# EAGLE design Zio Qwiic Light Sensor TSL2561 (EAGLE 9.1.1)
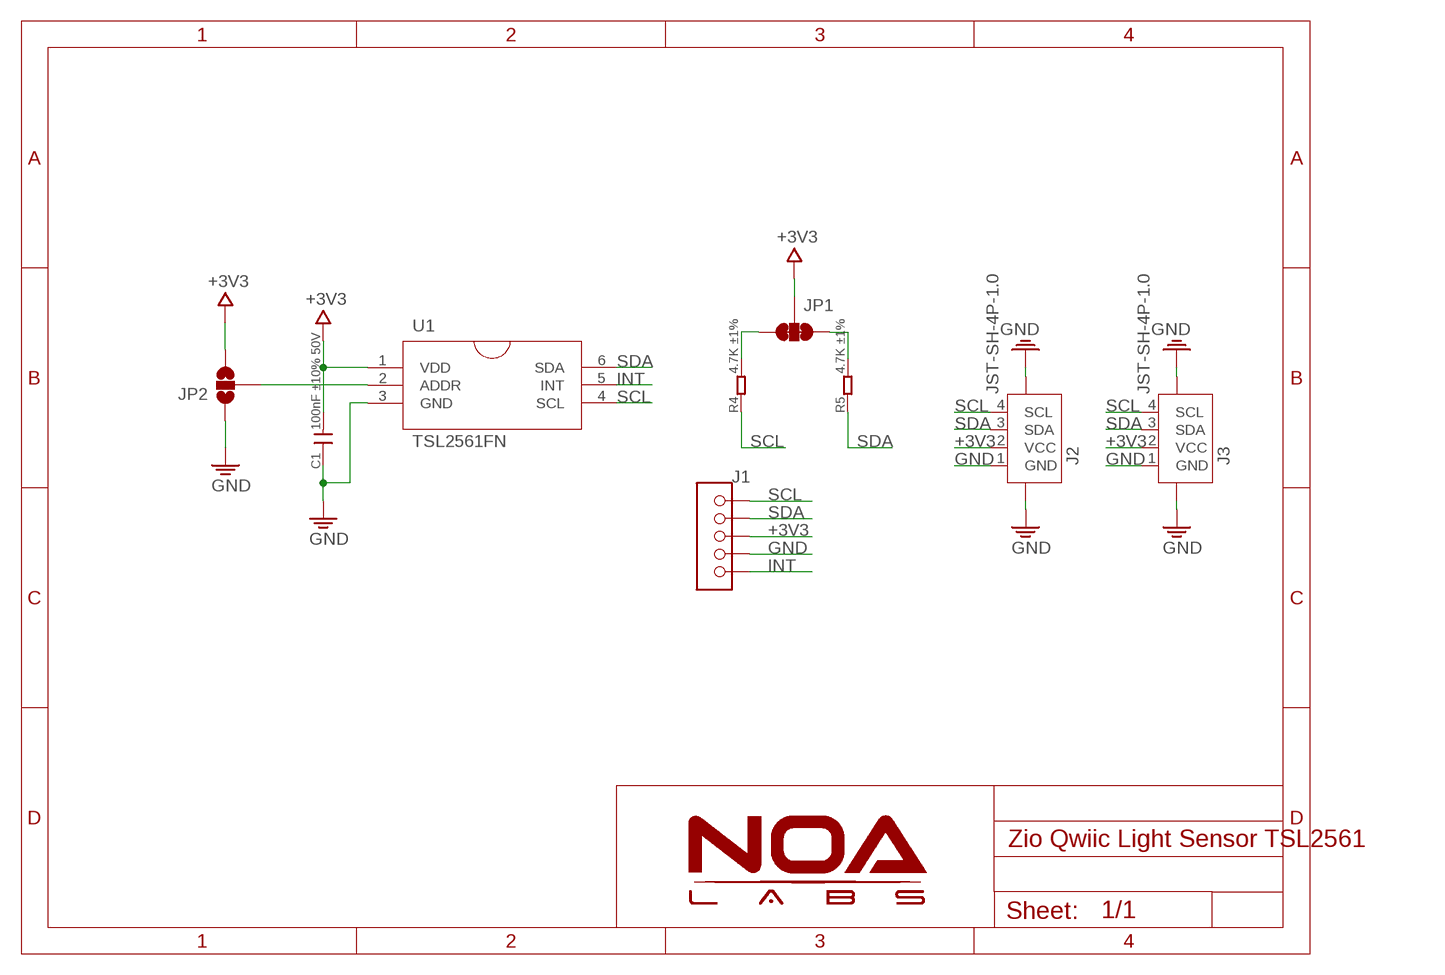
[diagram p0: schematic, sheet 1]

## Parts
C1  100nF ±10% 50V  C-0603  [C0603]
J1  HEADER-5P-2.54  [5P-2.54]
J2  JST-SH-4P-1.0  [JST-SH-4P]
J3  JST-SH-4P-1.0  [JST-SH-4P]
JP1  SMT-JUMPER_3_2-NC_TRACE  [SMT-JUMPER_3_2-NC_TRACE]
JP2  JUMPER-SMT_3_2-NC_PASTE_NOCREM  [SMT-JUMPER_3_2-NC_PASTE_SILK_NOCREM]
R4  4.7K ±1%  R-0603  [R0603]
R5  4.7K ±1%  R-0603  [R0603]
U1  TSL2561FN  [FN6]

## Nets
+3V3: C1.2 J1.3 J2.2(VCC) J3.2(VCC) JP1.2 JP2.3 U1.1(VDD)
GND: C1.1 J1.4 J2.1(GND) J2.NC1 J2.NC2 J3.1(GND) J3.NC1 J3.NC2 JP2.1 U1.3(GND)
INT: J1.5 U1.5(INT)
N$1: JP2.2 U1.2(ADDR)
N$6: JP1.3 R4.2
N$8: JP1.1 R5.2
SCL: J1.1 J2.4(SCL) J3.4(SCL) R4.1 U1.4(SCL)
SDA: J1.2 J2.3(SDA) J3.3(SDA) R5.1 U1.6(SDA)

## Library data of the parts
C1 = RCL:C
J1 = Connector:HEADER-5P
J2 J3 = Connector:JST-SH-4P
JP1 = NOA-Jumpers:SMT-JUMPER_3_2-NC_TRACE
JP2 = NOA-Jumpers:JUMPER-SMT_3_2-NC_PASTE_NOCREM
R4 R5 = RCL:R
U1 = IC:TSL2561FN

## Board
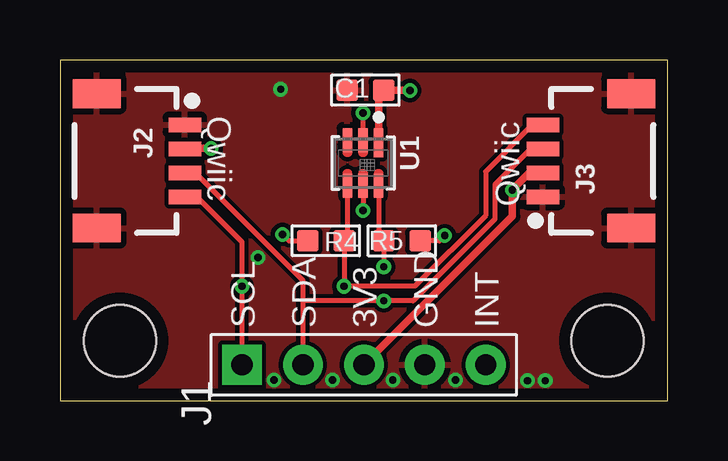
[diagram p1: board, top side]
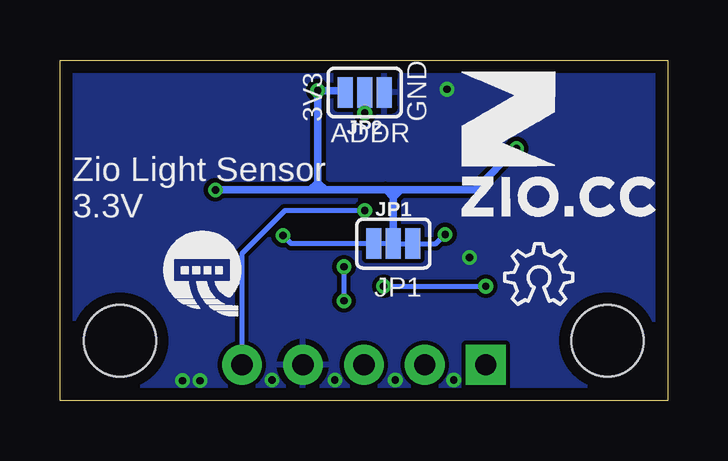
[diagram p2: board, bottom side, seen from below]

Size 25.32 x 14.2 mm. Coordinates in mm from the lower left corner, seen from the top.
Outline: 0,0 25.32,0 25.32,14.2 0,14.2 0,0
Copper layers (1*16): Top 0.035mm / dielectric 1.5mm / Bottom 0.035mm
Design rules "NOA Eagle Rule": minimum track width 7mil, minimum drill 12mil, track to track 7mil, track to pad 7mil, pad to pad 7mil, via to via 7mil, smd to smd 0mil, copper to edge 20mil, drill to drill 10mil, minimum pad ring 10mil, minimum via ring 6mil, stop-mask expansion 2mil, vias tented up to drill 25mil, thermal gap 10mil
Holes 3 mm at 2.5,2.5 22.82,2.5

### Footprints (pad centres in the part's own frame; a part is rotated, then mirrored left to right if it is on the bottom)
C0603 = smd 0.889 x 0.889: 1 -0.762,0; 2 0.762,0
5P-2.54 = drill 0.889 pad 1.651 square: 1 0,5.08 | drill 0.889 pad 1.651: 2 0,2.54; 3 0,0; 4 0,-2.54; 5 0,-5.08
JST-SH-4P = smd 0.6 x 1.35: 1 1.5,0; 2 0.5,0; 3 -0.5,0; 4 -1.5,0 | smd 1.2 x 2: NC1 -2.8,3.675; NC2 2.8,3.675
SMT-JUMPER_3_2-NC_TRACE = smd 0.635 x 1.27: 1 -0.813,0; 2 0,0; 3 0.813,0
SMT-JUMPER_3_2-NC_PASTE_SILK_NOCREM = smd 0.635 x 1.27: 1 -0.813,0; 2 0,0; 3 0.813,0
R0603 = smd 0.889 x 0.889: 1 -0.762,0; 2 0.762,0
FN6 = smd 1.2 x 0.4: 1 -0.85,0.65 | smd 1 x 0.4: 2 -0.95,0; 3 -0.95,-0.65; 4 0.95,-0.65; 5 0.95,0; 6 0.95,0.65

### Placement (x,y rotation side)
C1  12.73,12.94 0 top
J1  12.66,1.5 90 top
J2  5.2,10 90 top
J3  20.12,10 270 top
JP1  11.43,6.55 0 bottom
JP2  12.62,12.85 180 bottom
R4  11.08,6.67 180 top
R5  14.24,6.67 0 top
U1  12.63,9.91 270 top
U$4  [6MM]  8.61,7.7 0 bottom
U$5  [QWIIC-LOGO-BASIC]  19.43,5.28 0 bottom
U$6  [OSHW_6X100_NOTEXT]  6.78,4.01 0 bottom

### Tracks (layer width: path | path; a pad name or v marks a point on that pad's centre or on a via)
+3V3  (via drill 0.3)
  Top 0.305: J3.2 19.56,9.5 v18.85,8.79 18.85,7.69 J1.3 | v6.3,10.52 5.22,10.52 J2.2 | v14.58,12.93 14.57,12.94 C1.2 13.28,12.73 U1.1
  Bottom 0.305: v18.85,8.79 14.94,8.79 | 14.94,8.79 14.28,8.79 | 14.28,8.79 11.79,8.79 | 11.79,8.79 11.12,8.79 | 11.12,8.79 8.03,8.79 v6.3,10.52 | 14.58,9.09 v14.58,12.93 13.52,12.93 JP2.3 | 14.58,9.09 14.28,8.79 | 14.58,9.09 14.88,8.79 14.94,8.79 | 11.43,8.48 11.12,8.79 | 11.43,8.48 11.73,8.79 11.79,8.79 | JP1.2 11.43,8.48
GND  (via drill 0.3)
  other vias: 16.48,0.86 13.87,0.86 11.35,0.86 8.92,0.86 19.48,0.84 20.22,0.84 8.26,5.97 9.19,12.98
  pour Bottom: 0,14.2 25.32,14.2 25.32,0 0,0
  pour Top: 0,14.2 25.32,14.2 25.32,0 0,0
INT  (via drill 0.3)
  Top 0.203: v12.62,7.92 12.62,7.93 12.63,7.95 U1.5
  Bottom 0.203: v12.62,7.92 15.95,7.92 17.74,6.14 J1.5
N$1  (via drill 0.3)
  Top 0.203: v12.62,11.99 v12.62,11.98 12.63,11.97 U1.2
  Bottom 0.203: v12.62,11.99 JP2.2
N$6  (via drill 0.3)
  Top 0.203: v9.27,6.93 9.54,6.67 R4.2
  Bottom 0.203: JP1.3 9.66,6.55 v9.27,6.93
N$8  (via drill 0.3)
  Top 0.203: v16.03,6.88 15.81,6.67 R5.2
  Bottom 0.203: JP1.1 15.69,6.55 v16.03,6.88
SCL  (via drill 0.3)
  Top 0.203: J2.4 5.7,8.5 7.58,6.62 7.58,5.31 v7.58,4.78 J1.1 | J3.4 19.68,11.5 17.73,9.55 17.73,7.72 14.79,4.78 v11.84,4.78 R4.1 11.98,6.81 U1.4
  Bottom 0.203: v11.84,4.78 v7.58,4.78
SDA  (via drill 0.3)
  Top 0.203: J2.3 5.64,9.5 10.01,5.13 10.12,5.02 10.12,5 10.12,4.85 10.12,4.17 | 10.12,4.17 J1.2 | J3.3 19.62,10.5 18.12,9 18.12,7.99 18.12,7.57 14.71,4.17 v13.49,4.17 10.12,4.17 | U1.6 13.28,6.87 R5.1 13.48,5.6 v13.49,5.59
  Bottom 0.203: v13.49,5.59 v13.49,4.17

### Text on the board
tPlace: Qwiic | Qwiic | SCL | SDA | 3V3 | GND | INT
bPlace: GND | 3V3 | ADDR | Zio Light Sensor / 3.3V | JP1